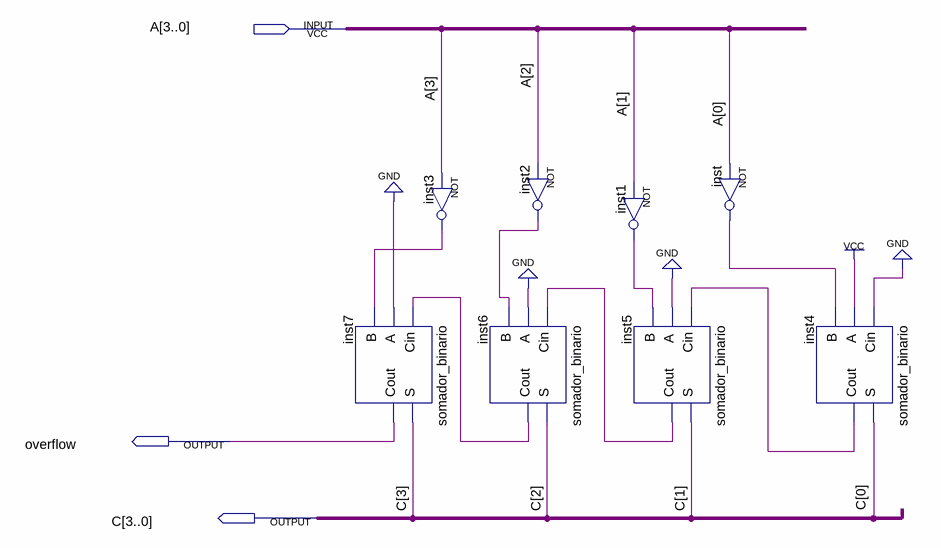
[diagram p0: schematic sheet]
// Quartus schematic complementador.bdf as structural Verilog: 8 symbols, 3 pins
module complementador (
  input  [3:0] A,
  output overflow,
  output [3:0] C
);

  wire inst1_out, inst2_out, inst3_out, inst4_cout, inst5_cout, inst6_cout, inst_out;

  somador_binario inst7 (.Cin(inst6_cout), .A(1'b0), .B(inst3_out), .S(C[3]), .Cout(overflow));
  not inst3 (inst3_out, A[3]);
  somador_binario inst6 (.Cin(inst5_cout), .A(1'b0), .B(inst2_out), .S(C[2]), .Cout(inst6_cout));
  not inst2 (inst2_out, A[2]);
  not inst1 (inst1_out, A[1]);
  somador_binario inst5 (.Cin(inst4_cout), .A(1'b0), .B(inst1_out), .S(C[1]), .Cout(inst5_cout));
  not inst (inst_out, A[0]);
  somador_binario inst4 (.Cin(1'b0), .A(1'b1), .B(inst_out), .S(C[0]), .Cout(inst4_cout));
endmodule
